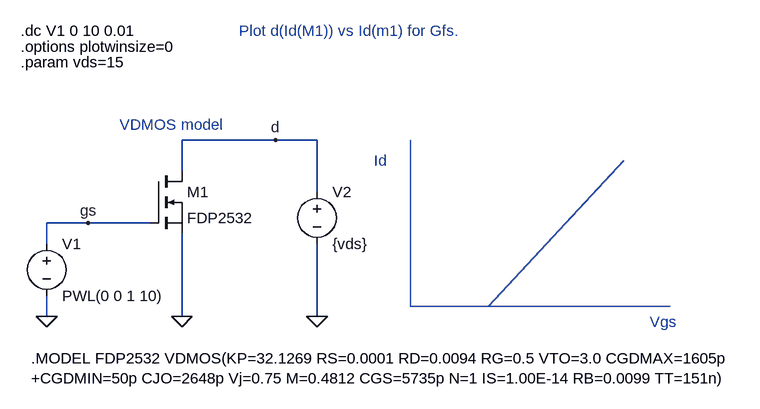
[diagram p0: schematic FDP2532_Id(Vgs).asc]
FDP2532_Id(Vgs).asc, the LTspice schematic file:
Version 4
SHEET 1 2828 1468
WIRE 256 400 112 400
WIRE 320 400 256 400
WIRE 112 448 112 400
WIRE 320 480 320 400
WIRE -32 528 -96 528
WIRE 64 528 -32 528
WIRE -96 560 -96 528
WIRE -96 672 -96 640
WIRE 112 672 112 544
WIRE 320 672 320 560
FLAG -96 672 0
FLAG 112 672 0
FLAG -32 528 gs
FLAG 256 400 d
FLAG 320 672 0
SYMBOL voltage -96 544 R0
WINDOW 123 0 0 Left 0
WINDOW 39 0 0 Left 0
SYMATTR InstName V1
SYMATTR Value PWL(0 0 1 10)
SYMBOL voltage 320 464 R0
WINDOW 123 0 0 Left 0
WINDOW 39 0 0 Left 0
SYMATTR InstName V2
SYMATTR Value {vds}
TEXT -136 232 Left 0 !.dc V1 0 10 0.01
TEXT 408 432 Left 0 ;Id
TEXT 832 680 Left 0 ;Vgs
TEXT -136 256 Left 0 !.options plotwinsize=0
TEXT 16 376 Left 0 ;VDMOS model
TEXT 200 232 Left 0 ;Plot d(Id(M1)) vs Id(m1) for Gfs.
LINE Normal 464 656 464 400
LINE Normal 864 656 464 656
LINE Normal 584 656 472 656
LINE Normal 792 432 584 656
SYMBOL NMOS 64 448 R0
SYMATTR InstName M1
SYMATTR Value FDP2532
TEXT -136 280 Left 0 !.param vds=15
TEXT -120 736 Left 0 !.MODEL FDP2532 VDMOS(KP=32.1269 RS=0.0001 RD=0.0094 RG=0.5 VTO=3.0 CGDMAX=1605p \n+CGDMIN=50p CJO=2648p Vj=0.75 M=0.4812 CGS=5735p N=1 IS=1.00E-14 RB=0.0099 TT=151n)

The netlist it stands for:
* FDP2532_Id(Vgs).asc
V1 gs 0 PWL(0 0 1 10)
V2 d 0 {vds}
M1 d gs 0 0 FDP2532
.model NMOS NMOS
.model PMOS PMOS
.lib standard.mos
.dc V1 0 10 0.01
* Id
* Vgs
.options plotwinsize=0
* VDMOS model
* Plot d(Id(M1)) vs Id(m1) for Gfs.
.param vds=15
.MODEL FDP2532 VDMOS(KP=32.1269 RS=0.0001 RD=0.0094 RG=0.5 VTO=3.0 CGDMAX=1605p
+CGDMIN=50p CJO=2648p Vj=0.75 M=0.4812 CGS=5735p N=1 IS=1.00E-14 RB=0.0099 TT=151n)
.backanno
.end